# EAGLE design JM Logics I2C SMD Adapter v0.1 (EAGLE 6.5.0)
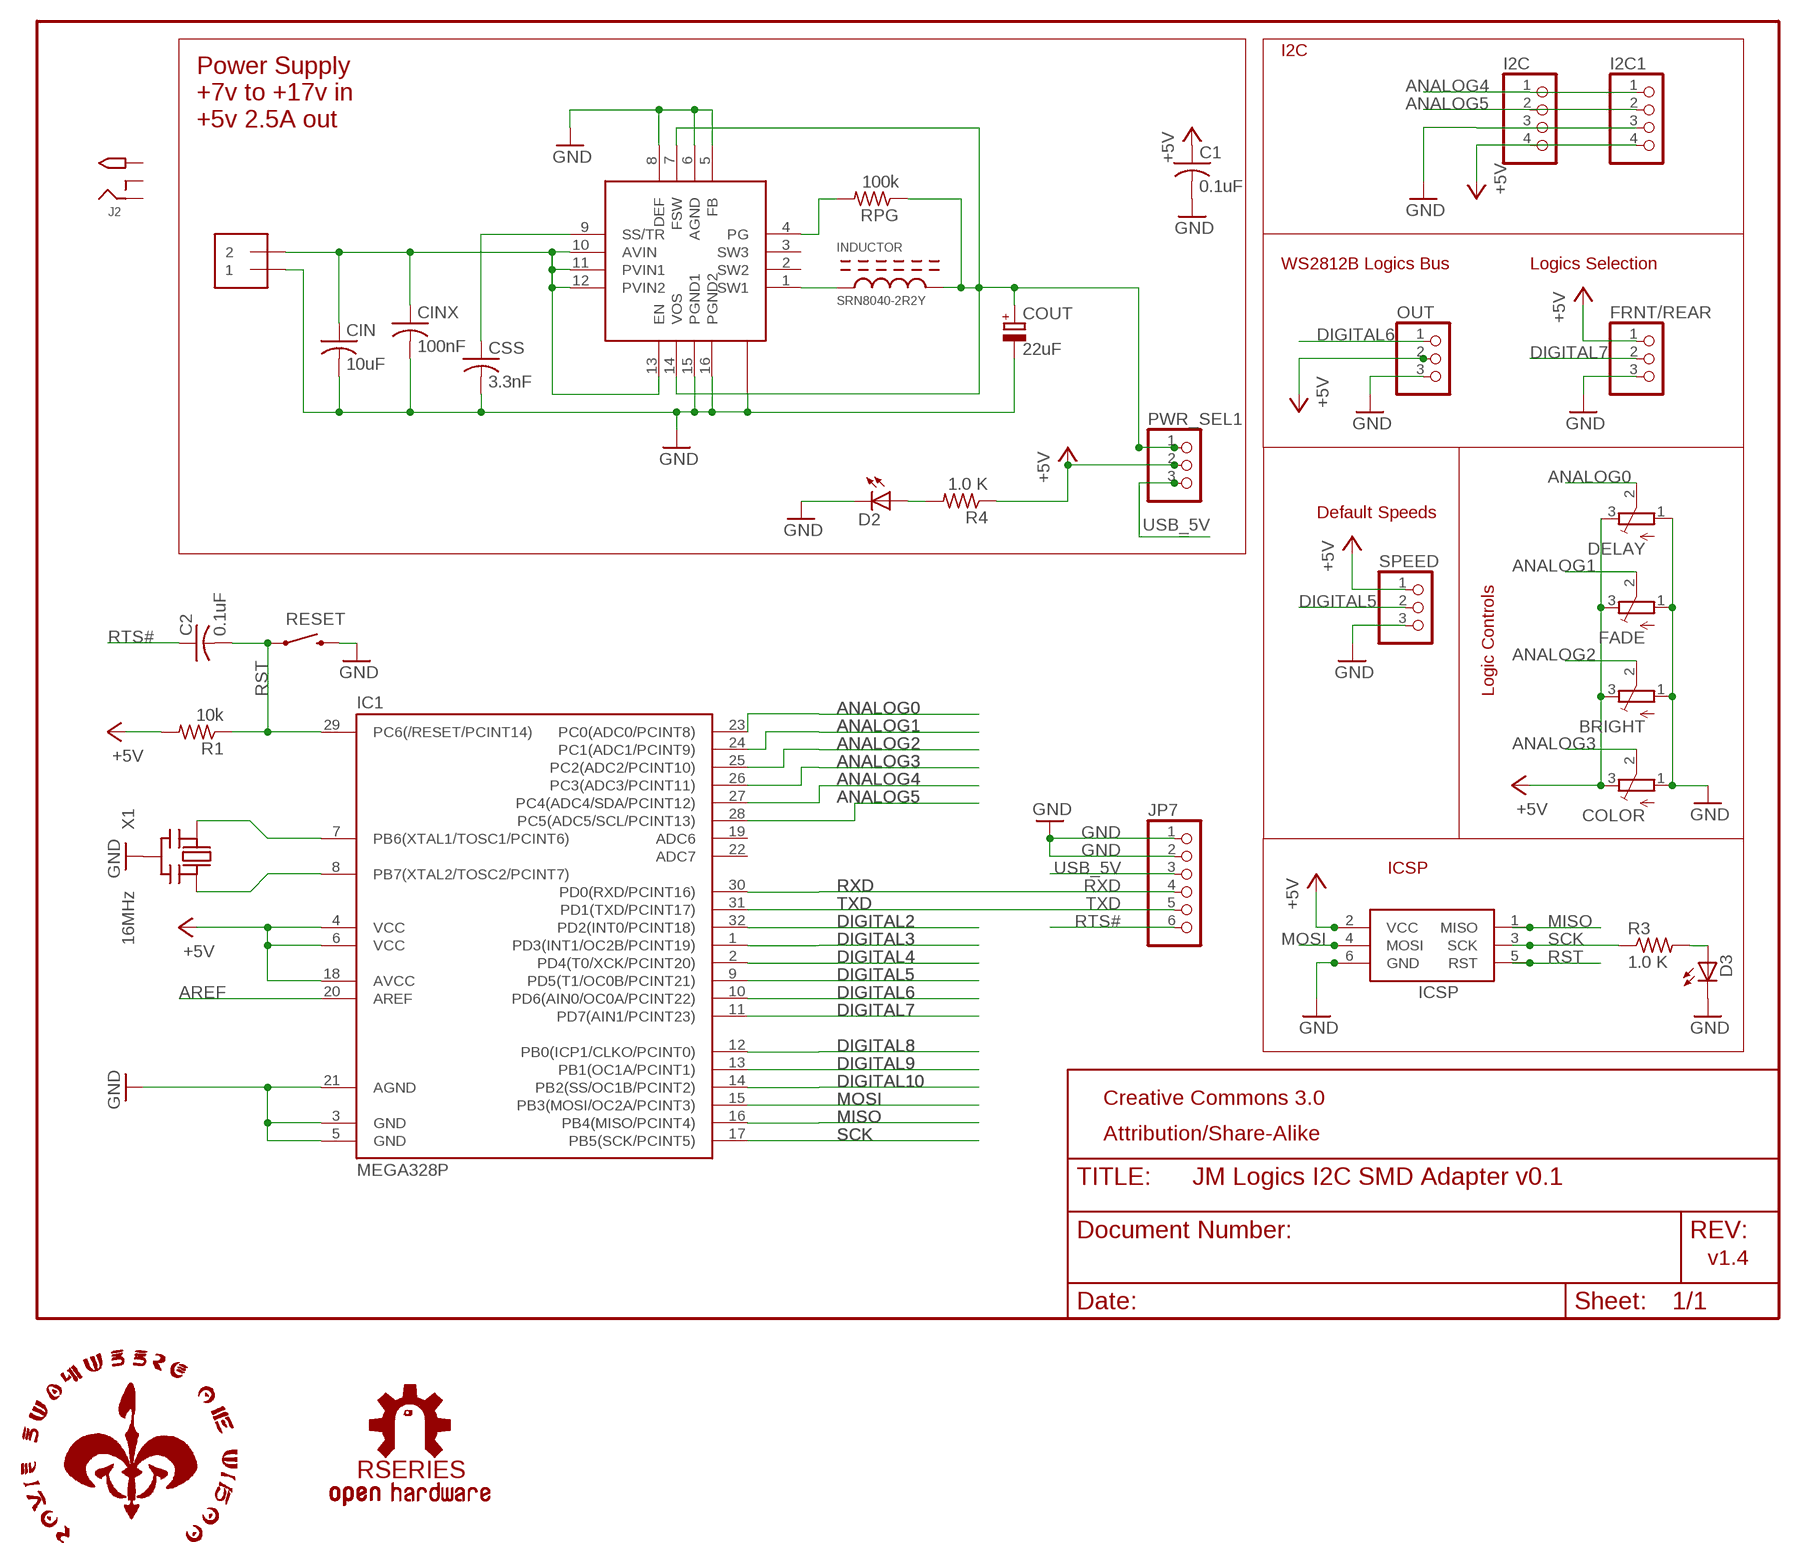
[diagram p0: schematic, sheet 1]

## Parts
BRIGHT  TRIMPOTTC33X  [TC33X]
C1  0.1uF  C-USC1206K  [C1206K]
C2  0.1uF  C-USC0805K  [C0805K]
CIN  10uF  C-USC0805K  [C0805K]
CINX  100nF  C-USC0805K  [C0805K]
COLOR  TRIMPOTTC33X  [TC33X]
COUT  22uF  CAPACITOR_POL-CASE_B  [CASE_B]
CSS  3.3nF  C-USC0805K  [C0805K]
D2  LEDCHIPLED_1206  [CHIPLED_1206]
D3  Green  LEDCHIPLED_1206  [CHIPLED_1206]
DELAY  TRIMPOTTC33X  [TC33X]
EXT.PWR  1X2-3.5MM  [1X2-3.5MM]
FADE  TRIMPOTTC33X  [TC33X]
FRNT/REAR  PINHD-1X3  [1X03]
I2C  PINHD-1X4CB  [1X04-CB]
I2C1  PINHD-1X4CB  [1X04-CB]
IC1  MEGA328P  MEGA48/88/168-AU  [TQFP32-08]
ICSP  AVRISP-6  [AVRISP]
INDUCTOR  SRN8040-2R2Y  SRN8040  [SRN8040]
J2  2.1MMJACK  [PJ-102A]
JP7  PINHD-1X6CLEAN  [1X06-CLEAN]
OUT  PINHD-1X3  [1X03]
PWR_SEL1  PINHD-1X3  [1X03]
R1  10k  R-US_R0805  [R0805]
R3  1.0 K  R-US_M1206  [M1206]
R4  1.0 K  R-US_M1206  [M1206]
REG  TPS62133  TPS6213X  [TPS6213X]
RESET  SWITCH-MOMENTARY-2SMD  [TACTILE_SWITCH_SMD]
RPG  100k  R-US_R0805  [R0805]
SPEED  PINHD-1X3  [1X03]
U$1  ROYAL-ENGINEERS-OF-NABOOSMALL  [ROYAL-ENGINEERS-OF-NABOO-SMALL]
U$2  RSERIES-OSHW-LOGOMEDIUM  [RSERIES-OSHW-LOGO-MEDIUM]
X1  16MHz  CERMOSCILL  [CERM_OSC]

## Nets
+5V [supply]: BRIGHT.3(E) C1.1 COLOR.3(E) DELAY.3(E) FADE.3(E) FRNT/REAR.1 I2C1.4 I2C.4 IC1.4(VCC) IC1.6(VCC) IC1.18(AVCC) ICSP.2(VCC) OUT.2 PWR_SEL1.2 R1.2 R4.1 SPEED.1
ANALOG0: DELAY.2(S) IC1.23(PC0(ADC0/PCINT8))
ANALOG1: FADE.2(S) IC1.24(PC1(ADC1/PCINT9))
ANALOG2: BRIGHT.2(S) IC1.25(PC2(ADC2/PCINT10))
ANALOG3: COLOR.2(S) IC1.26(PC3(ADC3/PCINT11))
ANALOG4: I2C1.1 I2C.1 IC1.27(PC4(ADC4/SDA/PCINT12))
ANALOG5: I2C1.2 I2C.2 IC1.28(PC5(ADC5/SCL/PCINT13))
AREF: IC1.20(AREF)
DIGITAL2: IC1.32(PD2(INT0/PCINT18))
DIGITAL3: IC1.1(PD3(INT1/OC2B/PCINT19))
DIGITAL4: IC1.2(PD4(T0/XCK/PCINT20))
DIGITAL5: IC1.9(PD5(T1/OC0B/PCINT21)) SPEED.2
DIGITAL6: IC1.10(PD6(AIN0/OC0A/PCINT22)) OUT.1
DIGITAL7: FRNT/REAR.2 IC1.11(PD7(AIN1/PCINT23))
DIGITAL8: IC1.12(PB0(ICP1/CLKO/PCINT0))
DIGITAL9: IC1.13(PB1(OC1A/PCINT1))
DIGITAL10: IC1.14(PB2(SS/OC1B/PCINT2))
GND [supply]: BRIGHT.1(A) C1.2 CIN.2 CINX.2 COLOR.1(A) COUT.- CSS.2 D2.C D3.C DELAY.1(A) EXT.PWR.1 FADE.1(A) FRNT/REAR.3 I2C1.3 I2C.3 IC1.3(GND) IC1.5(GND) IC1.21(AGND) ICSP.6(GND) JP7.1 JP7.2 OUT.3 REG.5(FB) REG.6(AGND) REG.8(DEF) REG.15(PGND1) REG.16(PGND2) REG.17-THERMALPAD(THERM) RESET.3 SPEED.3 X1.P$2(GND)
MISO: IC1.16(PB4(MISO/PCINT4)) ICSP.1(MISO)
MOSI: IC1.15(PB3(MOSI/OC2A/PCINT3)) ICSP.4(MOSI)
N$1: IC1.7(PB6(XTAL1/TOSC1/PCINT6)) X1.P$1(IN)
N$2: IC1.8(PB7(XTAL2/TOSC2/PCINT7)) X1.P$3(OUT)
N$3: INDUCTOR.P$1(P1) REG.1(SW1)
N$4: D3.A R3.2
N$5 [supply]: D2.A R4.2
N$6 [supply]: CIN.1 CINX.1 EXT.PWR.2 REG.10(AVIN) REG.11(PVIN1) REG.12(PVIN2) REG.13(EN)
N$7: CSS.1 REG.9(SS/TR)
N$8: REG.4(PG) RPG.2
N$9 [supply]: COUT.+ INDUCTOR.P$2(P2) PWR_SEL1.1 REG.7(FSW) REG.14(VOS) RPG.1
RST: C2.2 IC1.29(PC6(/RESET/PCINT14)) ICSP.5(RST) R1.1 RESET.1
RTS#: C2.1 JP7.6
RXD: IC1.30(PD0(RXD/PCINT16)) JP7.4
SCK: IC1.17(PB5(SCK/PCINT5)) ICSP.3(SCK) R3.1
TXD: IC1.31(PD1(TXD/PCINT17)) JP7.5
USB_5V [supply]: JP7.3 PWR_SEL1.3
Unconnected: IC1.19(ADC6) IC1.22(ADC7) J2.RING J2.RING_SW J2.TIP REG.2(SW2) REG.3(SW3)

## Notes on the sheet
- I2C
- Power Supply
  +7v to +17v in
  +5v 2.5A out
- WS2812B Logics Bus | Logics Selection
- Default Speeds
- Logic Controls
- ICSP
- Creative Commons 3.0
- Attribution/Share-Alike
- v1.4

## Library data of the parts
BRIGHT COLOR DELAY FADE = adafruit:TRIMPOT: SMT trimmer potentiometer part number TC33X http://www.ladyada.net/library/eagle
C1 = minimidi:C-US: CAPACITOR, American symbol
C2 CIN CINX CSS = adafruit:C-US: CAPACITOR, American symbol
COUT = dp_devices:CAPACITOR_POL: Polarized capacitor in various packages
D2 D3 = minimidi:LED: LED OSRAM: - CHIPLED LG R971, LG N971, LY N971, LG Q971, LY Q971, LO R971, LY R971 LH N974, LH R974 LS Q976, LO Q976, LY Q976 LO Q996 - Hyper CHIPLED LW Q18S LB Q993, LB Q99A, LB R99A - SideLED LS A670, LO A670, LY A670, LG A670, LP A670 LB A673, LV A673, LT A673, LW A673 LH A674 LY A675 LS A676, LA A676, LO A676, LY A676, LW A676 LS A679, LY A679, LG A679 - Hyper Micro SIDELED® LS Y876, LA Y876, LO Y876, LY Y876 LT Y87S - SmartLED LW L88C, LW L88S LB L89C, LB L89S, LG L890 LS L89K, LO L89K, LY L89K LS L896, LA L896, LO L896, LY L896 - TOPLED LS T670, LO T670, LY T670, LG T670, LP T670 LSG T670, LSP T670, LSY T670, LOP T670, LYG T670 LG T671, LOG T671, LSG T671 LB T673, LV T673, LT T673, LW T673 LH T674 LS T676, LA T676, LO T676, LY T676, LB T676, LH T676, LSB T676, LW T676 LB T67C, LV T67C, LT T67C, LS T67K, LO T67K, LY T67K, LW E67C LS E67B, LA E67B, LO E67B, LY E67B, LB E67C, LV E67C, LT E67C LW T67C LS T679, LY T679, LG T679 LS T770, LO T770, LY T770, LG T770, LP T770 LB T773, LV T773, LT T773, LW T773 LH T774 LS E675, LA E675, LY E675, LS T675 LS T776, LA T776, LO T776, LY T776, LB T776 LHGB T686 LT T68C, LB T68C - Hyper Mini TOPLED® LB M676 - Mini TOPLED Santana® LG M470 LS M47K, LO M47K, LY M47K Source: http://www.osram.convergy.de/
EXT.PWR = adafruit:1X2: 3.5mm Terminal block http://www.ladyada.net/library/pcb/eaglelibrary.html
FRNT/REAR OUT PWR_SEL1 SPEED = pinhead:PINHD-1X3: PIN HEADER
I2C I2C1 = carduino:PINHD-1X4: PIN HEADER
IC1 = avr-7:MEGA48/88/168
ICSP = adafruit:AVRISP: AVR ISP HEADER Standard 6 pin header for AVR programming
INDUCTOR = joymonkey:SRN8040
J2 = minimidi:2.1MMJACK
JP7 = carduino:PINHD-1X6: PIN HEADER
R1 RPG = adafruit:R-US_: RESISTOR, American symbol
R3 R4 = minimidi:R-US_: RESISTOR, American symbol
REG = joymonkey:TPS6213X: TPS6213 3-17V 3A Step-Down Converter in 3x3 QFN Package The TPS6213X family is an easy to use synchronous step down DC-DC converter optimized for applications with high power density. A high switching frequency of typically 2.5MHz allows the use of small inductors and provides fast transient response as well as high output voltage accuracy by utilization of the DCS-Control™ topology. With its wide operating input voltage range of 3V to 17V, the devices are ideally suited for systems powered from either a Li-Ion or other batteries as well as from 12V intermediate power rails. It supports up to 3A continuous output current at output voltages between 0.9V and 6V (with 100% duty cycle mode). The device, available in adjustable and fixed output voltage versions, is packaged in a 16-pin QFN package measuring 3 × 3 mm (RGT).
RESET = SparkFun-Electromechanical:SWITCH-MOMENTARY-2: Various NO switches- pushbuttons, reed, etc
U$1 = rseries:ROYAL-ENGINEERS-OF-NABOO: Royal Engineers of Naboo Circle Logo
U$2 = rseries:RSERIES-OSHW-LOGO
X1 = digg:CERMOSCILL

## Net classes
1 supply: width 0.508 mm, drill 0.152 mm, clearance 0.203 mm

## Board
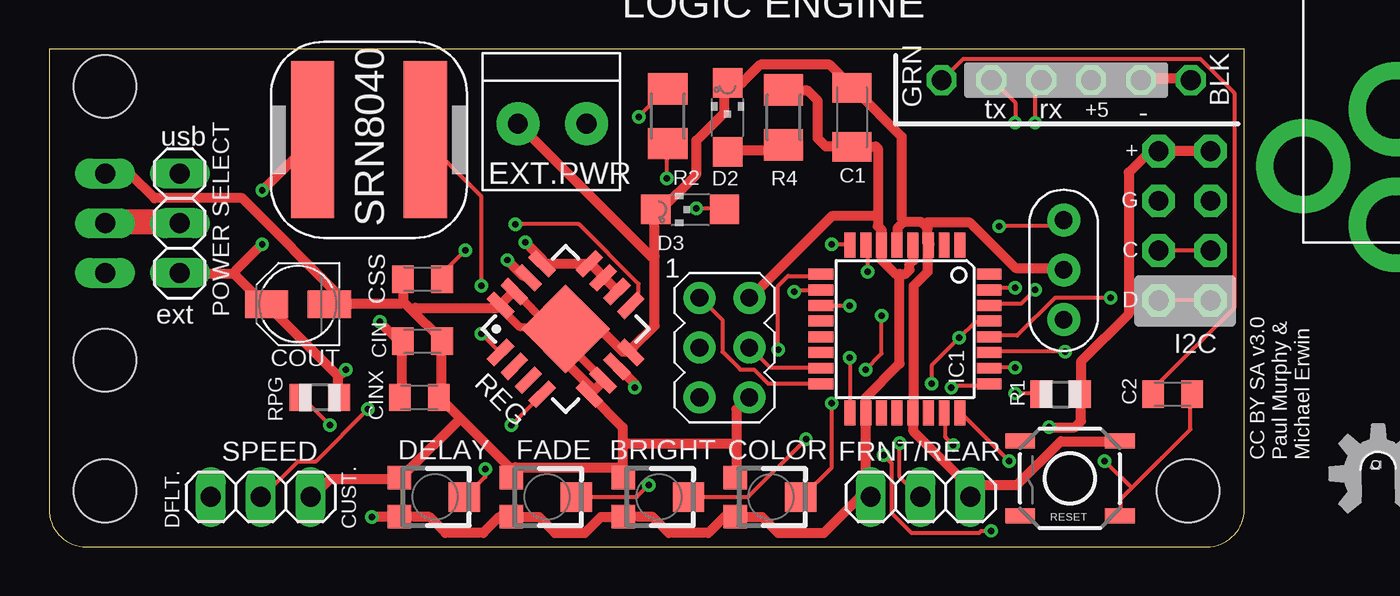
[diagram p1: board, top side]
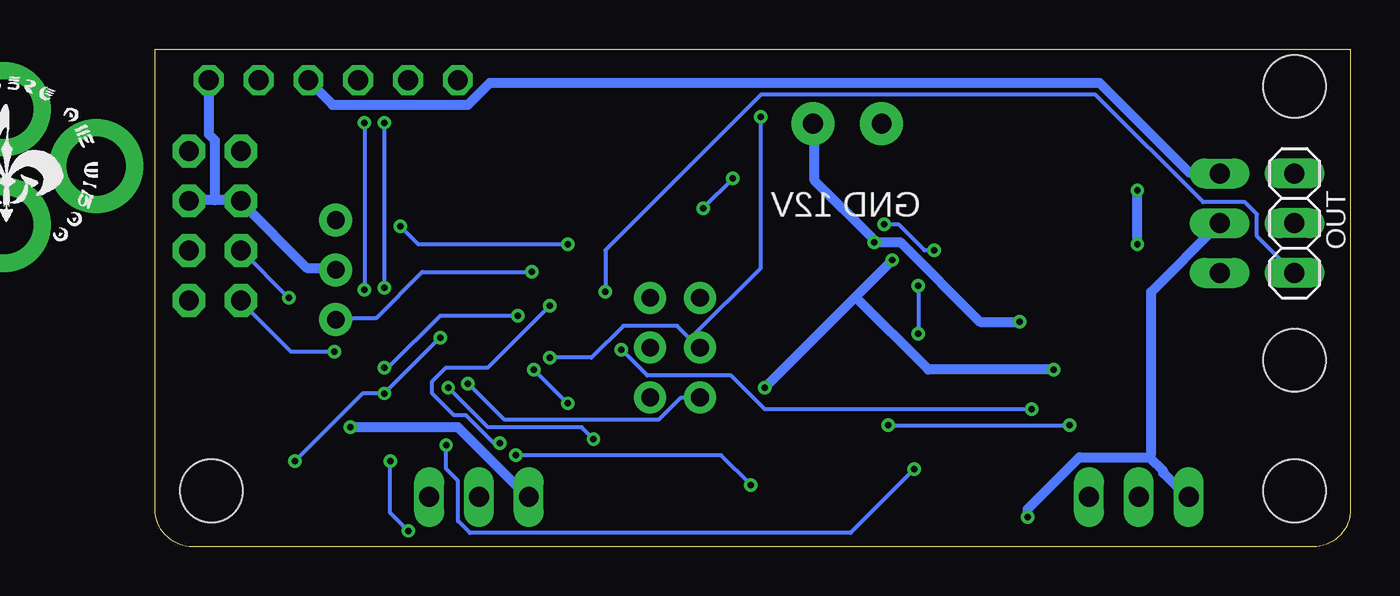
[diagram p2: board, bottom side, seen from below]

Size 60.96 x 25.4 mm. Coordinates in mm from the lower left corner, seen from the top.
Outline: 0,25.4 0,1.91 arc90 1.91,0 59.05,0 arc90 60.96,1.91 60.96,25.4 0,25.4
Copper layers (1*16): Top 0.0356mm / dielectric 1.5011mm / Bottom 0.0356mm
Design rules "LaenPCBOrder *": minimum track width 8mil, minimum drill 13mil, track to track 6mil, track to pad 6mil, pad to pad 6mil, via to via 12mil, smd to smd 6mil, copper to edge 15mil, drill to drill 6mil, minimum pad ring 7mil, minimum via ring 7mil, stop-mask expansion 4mil, vias tented up to drill 14mil, thermal gap 10mil
Holes 3.2 mm at 58.1,2.86 2.86,2.86 2.86,30.16 2.86,9.53 2.86,23.5

### Footprints (pad centres in the part's own frame; a part is rotated, then mirrored left to right if it is on the bottom)
TC33X = smd 1.2 x 1.2: 1 -1,-1.825; 3 1,-1.825 | smd 1.5 x 1.6: 2 0,1.5
C1206K = smd 1.5 x 2: 1 -1.5,0; 2 1.5,0
C0805K = smd 1.1 x 1.4: 1 -1,0; 2 1,0
CASE_B = smd 2.2 x 1.4: + 1.6,0; - -1.6,0
CHIPLED_1206 = smd 1.5 x 1.5: A 0,-1.75; C 0,1.75
1X2-3.5MM = drill 1 pad 2.184: 1 1.8,0; 2 -1.7,0
1X03 = drill 1.016 long: 1 -2.54,0; 2 0,0; 3 2.54,0
1X04-CB = drill 1.016 pad 1.676 octagon: 1 -3.81,0; 2 -1.27,0; 3 1.27,0; 4 3.81,0
TQFP32-08 = smd 1.27 x 0.559: 1 -4.293,2.8; 2 -4.293,2; 3 -4.293,1.2; 4 -4.293,0.4; 5 -4.293,-0.4; 6 -4.293,-1.2; 7 -4.293,-2; 8 -4.293,-2.8; 17 4.293,-2.8; 18 4.293,-2; 19 4.293,-1.2; 20 4.293,-0.4; 21 4.293,0.4; 22 4.293,1.2; 23 4.293,2; 24 4.293,2.8 | smd 0.559 x 1.27: 9 -2.8,-4.293; 10 -2,-4.293; 11 -1.2,-4.293; 12 -0.4,-4.293; 13 0.4,-4.293; 14 1.2,-4.293; 15 2,-4.293; 16 2.8,-4.293; 25 2.8,4.293; 26 2,4.293; 27 1.2,4.293; 28 0.4,4.293; 29 -0.4,4.293; 30 -1.2,4.293; 31 -2,4.293; 32 -2.8,4.293
AVRISP = drill 0.9 pad 1.626: 1 -1.27,2.54; 2 1.27,2.54; 3 -1.27,0; 4 1.27,0; 5 -1.27,-2.54; 6 1.27,-2.54
SRN8040 = smd 2.2 x 8: P$1 1.125,4; P$2 6.875,4
PJ-102A = drill 3 pad 4.8: RING 0.1,-3.39; RING_SW -4.6,-6.29; TIP 0.1,-9.29
1X06-CLEAN = drill 1.016 octagon: 1 -6.35,0; 2 -3.81,0; 3 -1.27,0; 4 1.27,0; 5 3.81,0; 6 6.35,0
R0805 = smd 1.1 x 1.4: 1 -1,0; 2 1,0
M1206 = smd 1.6 x 2: 1 -1.4,0; 2 1.4,0
TPS6213X = smd 1.45 x 0.55: 1 -3.2,1.5; 2 -3.2,0.5; 3 -3.2,-0.5; 4 -3.2,-1.5; 9 3.2,-1.5; 10 3.2,-0.5; 11 3.2,0.5; 12 3.2,1.5 | smd 0.55 x 1.45: 5 -1.5,-3.2; 6 -0.5,-3.2; 7 0.5,-3.2; 8 1.5,-3.2; 13 1.5,3.2; 14 0.5,3.2; 15 -0.5,3.2; 16 -1.5,3.2 | smd 3.2 x 3.2: 17-THERMALPAD 0,0
TACTILE_SWITCH_SMD = smd 1.524 x 0.762: 1 -2.54,1.905; 2 2.54,1.905; 3 -2.54,-1.905; 4 2.54,-1.905
CERM_OSC = drill 0.9 pad 1.676: P$1 -2.54,0; P$2 0,0; P$3 2.54,0

### Placement (x,y rotation side)
BRIGHT  31.11,2.54 270 top
C1  40.96,21.91 90 top
C2  57.31,7.78 0 top
CIN  19.05,10.48 0 top
CINX  18.89,7.62 0 top
COLOR  36.83,2.54 270 top
COUT  12.7,12.38 180 top
CSS  19.05,13.65 180 top
D2  34.61,21.91 0 top
D3  32.7,17.21 90 top
DELAY  19.68,2.54 270 top
EXT.PWR  25.72,21.59 180 top
FADE  25.4,2.54 270 top
FRNT/REAR  44.45,2.54 0 top
I2C  56.59,16.38 90 top
I2C1  59.25,16.38 90 top
IC1  43.66,11.11 270 top
ICSP  34.45,10.16 0 top
INDUCTOR  20.32,24.77 180 top
J2  68.58,25.72 0 top  (outside the outline)
JP7  51.88,23.81 180 top
OUT  2.86,16.51 90 bottom
PWR_SEL1  6.67,16.51 90 top
R1  51.59,7.78 0 top
R3  31.56,21.97 270 top
R4  37.47,21.91 270 top
REG  26.35,11.11 45 top
RESET  52.07,3.49 180 top
RPG  13.81,7.62 180 top
SPEED  10.79,2.54 0 top
U$1  73.5,15.24 0 bottom  (outside the outline)
U$2  67.69,3.78 0 top  (outside the outline)
X1  51.75,14.13 90 top

### Tracks (layer width: path | path; a pad name or v marks a point on that pad's centre or on a via)
+5V  (via drill 0.33)
  Top 0.508: 42.27,16.87 42.27,20.32 42.16,20.42 41.05,20.42 C1.1 40.74,20.42 39.62,20.42 39.22,20.83 39.22,22.76 38.71,23.27 37.49,23.27 R4.1 | 42.27,16.87 42.27,16.36 42.47,16.15 42.47,15.44 IC1.6 42.47,15.14 42.47,14.63 43.18,13.92 43.38,13.92 | 43.38,13.92 43.69,13.92 43.89,14.12 43.89,14.43 44.09,14.63 44.09,15.34 IC1.4 | 42.27,16.87 39.93,16.87 35.76,12.7 ICSP.2 | I2C1.4 59.23,20.22 56.79,20.22 I2C.4 56.59,20.12 56.08,20.12 55.07,19.1 55.07,11.89 52.63,9.45 52.63,7.82 R1.2 52.63,7.62 52.63,6.4 52.32,6.1 v51,6.1 | 2.95,16.56 OUT.2 | 6.6,16.56 PWR_SEL1.2 | v16.46,1.52 17.68,1.52 DELAY.3 17.88,1.52 19.41,1.52 20.22,0.71 22.15,0.71 22.96,1.52 23.57,1.52 FADE.3 23.77,1.52 24.99,1.52 25.81,0.71 27.33,0.71 28.14,1.52 29.06,1.52 BRIGHT.3 29.36,1.52 30.79,1.52 31.6,0.71 33.63,0.71 34.44,1.52 34.95,1.52 COLOR.3 35.26,1.52 36.37,1.52 37.19,0.71 39.52,0.71 41.45,2.64 FRNT/REAR.1 41.86,2.54 41.66,2.74 41.66,6.81 IC1.18 41.66,7.01 41.66,7.62 43.38,9.35 43.38,13.92
  Top 1.27: 6.6,16.56 2.95,16.56
  Bottom 0.508: 10.26,4.57 9.55,3.86 9.55,3.76 8.33,2.54 SPEED.1 | 10.26,4.57 13.82,4.57 16.46,1.93 v16.46,1.52 | PWR_SEL1.2 6.71,16.46 10.16,13.01 10.16,4.78 10.26,4.57 | v51,6.1 45.52,6.1 41.96,2.54 FRNT/REAR.1
ANALOG0  (via drill 0.33)
  Top 0.203: v46.13,5.18 45.72,5.59 45.72,6.81 IC1.23 | v22.25,3.96 22.25,3.56 21.23,2.54 DELAY.2
  Bottom 0.203: v46.13,5.18 46.13,3.96 45.52,3.35 45.52,1.32 44.91,0.71 25.5,0.71 v22.25,3.96
ANALOG1  (via drill 0.33)
  Top 0.203: v48.97,4.37 46.53,6.81 IC1.24 | v48.06,0.81 47.55,0.81 47.45,0.71 43.99,0.71 42.98,1.73 42.98,4.27 v42.57,4.67 | v30.58,3.15 29.97,2.54 FADE.2
  Bottom 0.203: v48.97,4.37 48.97,1.73 v48.06,0.81 | v42.57,4.67 32.11,4.67 v30.58,3.15
ANALOG2  (via drill 0.33)
  Top 0.203: v46.02,8.13 46.13,8.23 47.85,8.23 IC1.25 | v38.61,5.49 35.66,2.54 BRIGHT.2
  Bottom 0.203: v46.02,8.13 43.99,6.1 39.22,6.1 v38.61,5.49
ANALOG3  (via drill 0.33)
  Top 0.203: v49.28,9.14 47.95,9.14 IC1.26 | v42.47,11.79 42.47,9.86 v41.66,9.04 | v39.93,7.32 39.93,4.06 38.41,2.54 COLOR.2
  Bottom 0.203: v49.28,9.14 49.07,9.14 46.43,11.79 v42.47,11.79 | v39.93,7.32 v41.66,9.04
ANALOG4  (via drill 0.33)
  Top 0.203: v51.82,9.96 47.95,9.96 IC1.27 | I2C1.1 59.23,12.6 56.59,12.6 I2C.1
  Bottom 0.203: v51.82,9.96 54.05,9.96 56.59,12.5 I2C.1
ANALOG5  (via drill 0.33)
  Top 0.203: v54.15,12.7 51.31,12.7 49.38,10.77 47.95,10.77 IC1.28 | I2C1.2 59.23,15.14 56.59,15.14 I2C.2
  Bottom 0.203: v54.15,12.7 56.59,15.14 I2C.2
DIGITAL5  (via drill 0.33)
  Top 0.203: v37.19,10.06 37.19,13.31 37.69,13.82 39.32,13.82 IC1.9 | v16.26,7.01 13.61,4.37 12.7,4.37 10.87,2.54 SPEED.2
  Bottom 0.203: v37.19,10.06 35.87,8.74 31.6,8.74 29.87,7.01 v16.26,7.01
DIGITAL6  (via drill 0.33)
  Top 0.203: v38,13.01 38.1,13.11 39.32,13.11 IC1.10
  Bottom 0.203: v38,13.01 38,15.14 30.07,23.06 13.01,23.06 7.52,17.58 5.38,17.58 4.78,16.97 4.78,15.85 2.95,14.02 OUT.1
DIGITAL7  (via drill 0.33)
  Top 0.203: v40.84,12.29 39.42,12.29 IC1.11 | v43.38,5.28 43.38,3.56 44.4,2.54 FRNT/REAR.2
  Bottom 0.203: v40.84,12.29 43.99,9.14 46.13,9.14 46.84,8.43 46.84,7.82 45.72,6.71 45.11,6.71 43.69,5.28 v43.38,5.28
GND
  Top 0.508: JP7.2 55.78,23.88 58.22,23.88 JP7.1 | RESET.3 54.56,5.38 51.61,5.38 49.38,3.15 47.14,3.15 FRNT/REAR.3 46.94,2.54 46.94,3.05 44.09,5.89 44.09,6.81 IC1.21 44.09,7.01 44.09,13.31 44.81,14.02 44.81,15.24 IC1.3 | 43.28,15.44 IC1.5 43.28,15.65 43.28,16.26 43.59,16.56 | 43.59,16.56 44.5,16.56 44.65,16.41 | 44.65,16.41 44.81,16.26 44.81,15.44 IC1.3 | 44.91,15.44 IC1.3 | 43.59,16.56 43.48,16.76 43.48,20.93 41.15,23.27 C1.2 40.95,23.47 39.83,24.59 36.27,24.59 35.36,23.67 34.65,23.67 D2.C 34.44,23.47 34.44,22.15 33.02,20.73 33.02,19 31.19,17.17 D3.C 30.89,17.17 30.89,14.83 | X1.P$2 51.71,14.22 49.28,14.22 46.94,16.56 44.81,16.56 44.65,16.41 | 35.05,5.28 35.05,7.01 35.66,7.62 ICSP.6 35.76,7.62 | 35.05,5.28 35.05,3.56 COLOR.1 | 29.26,5.28 29.26,6.1 27.64,7.72 REG.5 27.74,7.92 27.79,7.98 | 29.26,5.28 29.26,3.56 BRIGHT.1 29.06,4.06 23.77,4.06 FADE.1 23.57,3.56 23.57,3.96 20.98,6.55 | 27.79,7.98 28.25,8.43 REG.6 | 30.89,14.83 30.89,11.28 29.77,10.16 REG.8 29.67,9.96 29.26,9.96 28.14,11.07 26.42,11.07 REG.17-THERMALPAD 26.42,10.87 26.42,9.35 27.79,7.98 | 29.26,5.28 35.05,5.28 | EXT.PWR.1 23.98,21.54 30.68,14.83 30.89,14.83 | SPEED.3 13.41,2.54 14.33,3.45 17.78,3.45 DELAY.1 18.09,3.66 20.98,6.55 | REG.15 23.67,13.01 23.06,12.39 REG.16 22.86,12.19 18.69,12.19 18.54,12.04 | 20.98,6.55 19.91,7.62 CINX.2 20.02,7.82 20.02,10.46 CIN.2 19.91,10.67 18.54,12.04 | 18.09,12.5 18.09,13.61 CSS.2 | 18.54,12.04 18.09,12.5 | 18.09,12.5 17.88,12.39 14.33,12.39 COUT.- 15.04,12.6 9.86,17.78 5.38,17.78 4.17,19 2.95,19 OUT.3
  Bottom 0.508: X1.P$2 51.82,14.22 53.24,14.22 56.59,17.58 I2C.3 56.79,17.68 57.91,17.68 | 57.91,17.68 59.23,17.68 I2C1.3 | 57.91,17.68 57.91,20.73 58.22,21.03 58.22,23.77 JP7.1
MISO
  Top 0.203: IC1.16 39.32,8.33 36.68,8.33 35.97,9.04 35.26,9.04 34.34,9.96 34.34,11.58 33.22,12.7 ICSP.1
MOSI
  Top 0.203: IC1.15 39.32,9.14 36.78,9.14 35.76,10.16 ICSP.4
N$1  (via drill 0.33)
  Top 0.203: v41.76,14.02 41.76,15.34 IC1.7
  Bottom 0.203: v41.76,14.02 47.35,14.02 49.68,11.68 51.71,11.68 X1.P$1
N$2  (via drill 0.33)
  Top 0.203: v39.93,15.44 40.84,15.44 IC1.8 | v48.46,16.36 51.41,16.36 51.71,16.66 X1.P$3
  Bottom 0.203: v39.93,15.44 47.55,15.44 v48.46,16.36
N$3  (via drill 0.33)
  Top 0.203: v22.05,10.87 22.96,9.96 REG.1 | v22.05,13.31 22.05,17.88 19.2,20.73 INDUCTOR.P$1
  Bottom 0.203: v22.05,13.31 v22.05,10.87
N$4  (via drill 0.33)
  Top 0.203: v33.02,17.27 34.44,17.27 D3.A | v31.5,18.8 31.5,20.52 R3.2
  Bottom 0.203: v31.5,18.8 v33.02,17.27
N$5
  Top 0.508: D2.A 34.65,20.22 37.19,20.22 37.39,20.42 R4.2
N$6  (via drill 0.33)
  Top 0.508: CINX.1 17.98,7.62 17.98,10.46 CIN.1 17.78,10.57 v16.87,11.48 | REG.10 28.96,13.11 28.45,13.61 REG.11 28.25,13.82 27.74,14.33 REG.12 27.53,14.43 25.2,14.43 REG.13 25.2,14.63 v24.28,15.54
  Bottom 0.508: v16.87,11.48 18.9,11.48 22.96,15.54 v24.28,15.54 24.38,15.75 27.33,18.69 27.33,21.54 EXT.PWR.2
N$7  (via drill 0.33)
  Top 0.203: v21.23,15.14 20.12,14.02 20.12,13.72 CSS.1 | v23.77,16.46 27.03,16.46 30.07,13.41 30.07,12.7 29.77,12.39 REG.9
  Bottom 0.203: v21.23,15.14 21.74,15.14 23.06,16.46 v23.77,16.46
N$8  (via drill 0.33)
  Top 0.203: v14.33,6.2 12.9,7.62 RPG.2 | v23.57,6.2 25.09,7.72 REG.4
  Bottom 0.203: v23.57,6.2 v14.33,6.2
N$9  (via drill 0.33)
  Top 0.508: v23.37,14.63 24.18,13.82 24.38,13.82 REG.14 | v29.87,8.13 29.87,8.33 29.06,9.14 REG.7 | 14.73,8.74 14.73,7.62 RPG.1 | 14.73,8.74 11.18,12.29 COUT.+ 10.87,12.5 9.45,13.92 | 9.45,13.92 6.71,13.92 PWR_SEL1.1 | v15.14,9.04 14.94,8.84 14.73,8.74 | v10.87,18.19 13.41,20.73 INDUCTOR.P$2 | v10.87,15.44 9.55,14.12 9.45,13.92
  Bottom 0.508: v29.87,8.13 25.25,12.75 | 25.25,12.75 v23.37,14.63 | 25.25,12.75 21.54,9.04 v15.14,9.04 | v10.87,15.44 v10.87,18.19
RST  (via drill 0.33)
  Top 0.203: 55.22,3 54.66,2.44 54.66,1.63 RESET.1 | 55.22,3 58.22,5.99 58.22,7.72 C2.2 | v49.28,7.82 50.49,7.82 R1.1 | IC1.29 47.85,11.48 47.24,11.48 v46.43,10.67 45.01,9.25 v45.01,8.33 | v53.85,4.37 55.22,3
  Bottom 0.203: v46.43,10.67 v49.28,7.82 50.39,7.82 v53.85,4.37 | ICSP.5 34.14,7.62 35.26,6.5 43.18,6.5 v45.01,8.33
RTS#
  Top 0.203: C2.1 56.39,7.82 56.39,8.13 60.45,12.19 60.45,23.16 58.73,24.89 46.63,24.89 45.62,23.88 JP7.6
RXD  (via drill 0.33)
  Top 0.203: v50.29,13.11 49.58,12.39 47.95,12.39 IC1.30 | v50.29,21.64 50.29,23.47 50.6,23.77 JP7.4
  Bottom 0.203: v50.29,21.64 v50.29,13.11
SCK  (via drill 0.33)
  Top 0.203: v40.84,9.65 40.84,6.91 IC1.17 | v30.07,21.95 31.5,23.37 R3.1
  Bottom 0.203: v40.84,9.65 38.71,9.65 37.08,11.28 34.34,11.28 33.22,10.16 ICSP.3 33.63,10.67 30.07,14.22 v30.07,21.95
TXD  (via drill 0.33)
  Top 0.203: v49.28,13.21 47.95,13.21 IC1.31 | v49.28,21.64 49.28,22.66 48.16,23.77 JP7.5
  Bottom 0.203: v49.28,21.64 v49.28,13.21
USB_5V
  Bottom 0.508: PWR_SEL1.3 6.71,19.1 8.23,19.1 12.8,23.67 43.89,23.67 45.01,22.55 51.92,22.55 53.14,23.77 JP7.3

### Text on the board
Bottom: v1.4
tPlace: LOGIC ENGINE | tx | rx | +5 | - | GRN | BLK | usb | R2 | D3 | POWER SELECT | ext | CUST. | DFLT.
bPlace: GND 12V
_tsilk: + | G | C | D | CC BY SA v3.0 / Paul Murphy & / Michael Erwin